# EAGLE design so28 (EAGLE 5.11)
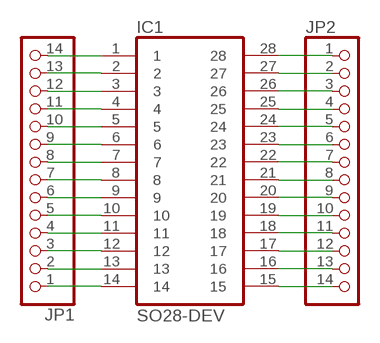
[diagram p0: schematic, sheet 1]

## Parts
IC1  SO28-DEV  [SO28W]
JP1  PINHD-1X14  [1X14]
JP2  PINHD-1X14  [1X14]

## Nets
N$1: IC1.1 JP1.14
N$2: IC1.2 JP1.13
N$3: IC1.3 JP1.12
N$4: IC1.4 JP1.11
N$5: IC1.5 JP1.10
N$6: IC1.6 JP1.9
N$7: IC1.7 JP1.8
N$8: IC1.8 JP1.7
N$9: IC1.9 JP1.6
N$10: IC1.10 JP1.5
N$11: IC1.11 JP1.4
N$12: IC1.12 JP1.3
N$13: IC1.13 JP1.2
N$14: IC1.14 JP1.1
N$15: IC1.15 JP2.14
N$16: IC1.16 JP2.13
N$17: IC1.17 JP2.12
N$18: IC1.18 JP2.11
N$19: IC1.19 JP2.10
N$20: IC1.20 JP2.9
N$21: IC1.21 JP2.8
N$22: IC1.22 JP2.7
N$23: IC1.23 JP2.6
N$24: IC1.24 JP2.5
N$25: IC1.25 JP2.4
N$26: IC1.26 JP2.3
N$27: IC1.27 JP2.2
N$28: IC1.28 JP2.1

## Library data of the parts
IC1 = packages:SO28-DEV
JP1 JP2 = pinhead:PINHD-1X14: PIN HEADER

## Board
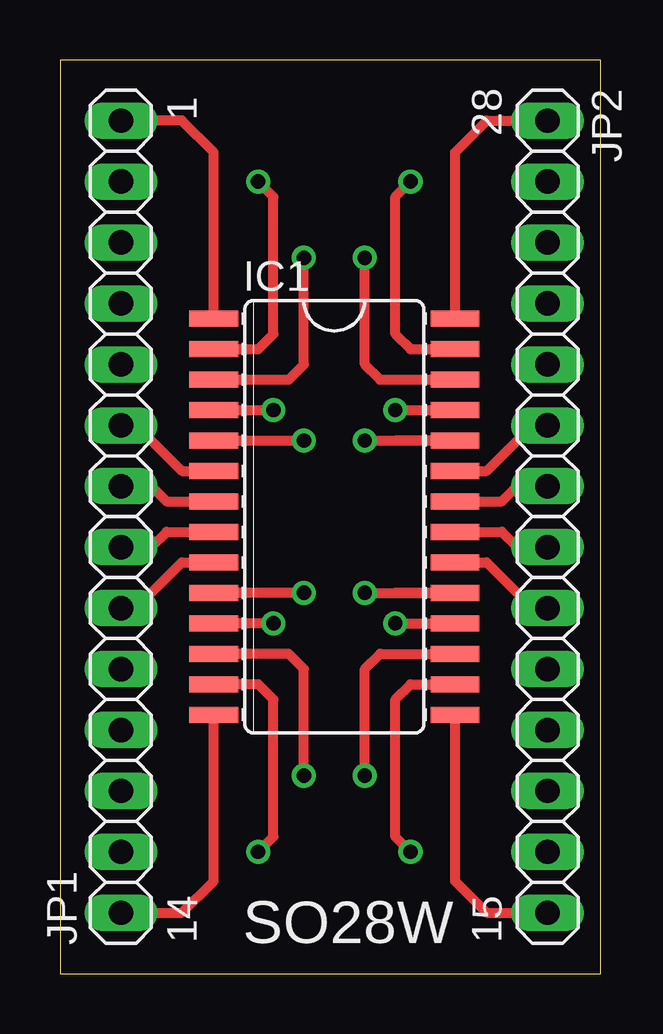
[diagram p1: board, top side]
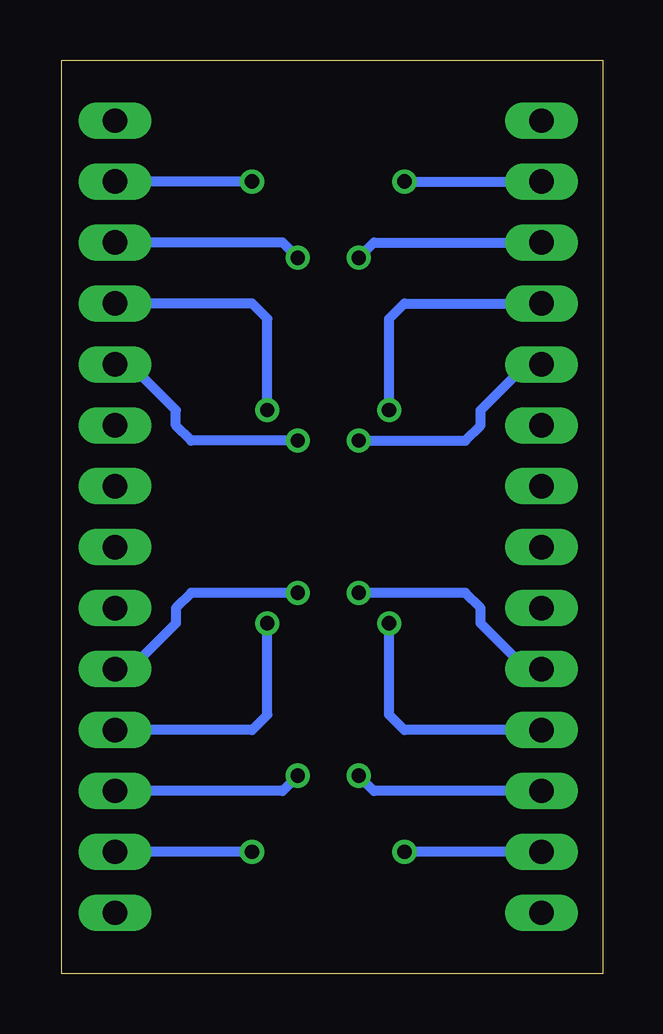
[diagram p2: board, bottom side, seen from below]

Size 22.53 x 38.09 mm. Coordinates in mm from the lower left corner, seen from the top.
Outline: 0,0 22.53,0 22.53,38.09 0,38.09 0,0
Copper layers (1*16): Top 0.035mm / dielectric 1.5mm / Bottom 0.035mm
Design rules "default": minimum track width 10mil, minimum drill 24mil, track to track 8mil, track to pad 8mil, pad to pad 8mil, via to via 8mil, smd to smd 8mil, copper to edge 40mil, drill to drill 8mil, minimum pad ring 10mil, minimum via ring 8mil, stop-mask expansion 4mil, vias tented up to drill 0mil, thermal gap 10mil

### Footprints (pad centres in the part's own frame; a part is rotated, then mirrored left to right if it is on the bottom)
SO28W = smd 0.66 x 2.032: 1 -8.255,-5.029; 2 -6.985,-5.029; 3 -5.715,-5.029; 4 -4.445,-5.029; 5 -3.175,-5.029; 6 -1.905,-5.029; 7 -0.635,-5.029; 8 0.635,-5.029; 9 1.905,-5.029; 10 3.175,-5.029; 11 4.445,-5.029; 12 5.715,-5.029; 13 6.985,-5.029; 14 8.255,-5.029; 15 8.255,5.029; 16 6.985,5.029; 17 5.715,5.029; 18 4.445,5.029; 19 3.175,5.029; 20 1.905,5.029; 21 0.635,5.029; 22 -0.635,5.029; 23 -1.905,5.029; 24 -3.175,5.029; 25 -4.445,5.029; 26 -5.715,5.029; 27 -6.985,5.029; 28 -8.255,5.029
1X14 = drill 1.016 long: 1 -16.51,0; 2 -13.97,0; 3 -11.43,0; 4 -8.89,0; 5 -6.35,0; 6 -3.81,0; 7 -1.27,0; 8 1.27,0; 9 3.81,0; 10 6.35,0; 11 8.89,0; 12 11.43,0; 13 13.97,0; 14 16.51,0

### Placement (x,y rotation side)
IC1  11.43,19.05 270 top
JP1  2.54,19.05 90 top
JP2  20.32,19.05 270 top

### Tracks (layer width: path | path; a pad name or v marks a point on that pad's centre or on a via)
N$1
  Top 0.406: IC1.1 6.4,34.24 5.08,35.56 JP1.14
N$2  (via drill 0.6)
  Top 0.406: IC1.2 8.26,26.04 8.89,26.67 8.89,32.38 v8.26,33.02
  Bottom 0.406: v8.26,33.02 JP1.13
N$3  (via drill 0.6)
  Top 0.406: IC1.3 9.53,24.77 10.16,25.4 v10.16,29.84
  Bottom 0.406: v10.16,29.84 9.53,30.48 JP1.12
N$4  (via drill 0.6)
  Top 0.406: IC1.4 v8.89,23.5
  Bottom 0.406: v8.89,23.5 8.89,27.3 8.26,27.94 JP1.11
N$5  (via drill 0.6)
  Top 0.406: 8.89,22.23 IC1.5 v10.16,22.23
  Bottom 0.406: v10.16,22.23 5.71,22.23 5.08,22.86 5.08,23.5 3.17,25.4 JP1.10
N$6
  Top 0.406: IC1.6 5.08,20.95 3.17,22.86 JP1.9
N$7
  Top 0.406: IC1.7 4.45,19.68 3.81,20.32 JP1.8
N$8
  Top 0.406: IC1.8 4.45,18.41 3.81,17.78 JP1.7
N$9
  Top 0.406: IC1.9 5.08,17.14 3.17,15.24 JP1.6
N$10  (via drill 0.6)
  Top 0.406: v10.16,15.88 IC1.10
  Bottom 0.406: v10.16,15.88 5.71,15.88 5.08,15.24 5.08,14.61 3.17,12.7 JP1.5
N$11  (via drill 0.6)
  Top 0.406: v8.89,14.61 IC1.11
  Bottom 0.406: v8.89,14.61 8.89,10.79 8.26,10.16 JP1.4
N$12  (via drill 0.6)
  Top 0.406: IC1.12 9.53,13.34 10.16,12.7 v10.16,8.26
  Bottom 0.406: v10.16,8.26 9.53,7.62 JP1.3
N$13  (via drill 0.6)
  Top 0.406: IC1.13 8.26,12.06 8.89,11.43 8.89,5.71 v8.26,5.08
  Bottom 0.406: JP1.2 v8.26,5.08
N$14
  Top 0.406: IC1.14 6.4,3.86 5.08,2.54 JP1.1
N$15
  Top 0.406: IC1.15 16.46,3.86 17.78,2.54 JP2.14
N$16  (via drill 0.6)
  Top 0.406: IC1.16 14.61,12.06 13.97,11.43 13.97,5.71 v14.61,5.08
  Bottom 0.406: v14.61,5.08 JP2.13
N$17  (via drill 0.6)
  Top 0.406: 16.51,13.34 IC1.17 13.34,13.34 12.7,12.7 v12.7,8.26
  Bottom 0.406: v12.7,8.26 13.34,7.62 JP2.12
N$18  (via drill 0.6)
  Top 0.406: v13.97,14.61 IC1.18
  Bottom 0.406: v13.97,14.61 13.97,10.79 14.61,10.16 JP2.11
N$19  (via drill 0.6)
  Top 0.406: 13.97,15.88 IC1.19 v12.7,15.88
  Bottom 0.406: v12.7,15.88 17.14,15.88 17.78,15.24 17.78,14.61 19.68,12.7 JP2.10
N$20
  Top 0.406: IC1.20 17.78,17.14 19.68,15.24 JP2.9
N$21
  Top 0.406: IC1.21 18.41,18.41 19.05,17.78 JP2.8
N$22
  Top 0.406: IC1.22 18.41,19.68 19.05,20.32 JP2.7
N$23
  Top 0.406: IC1.23 17.78,20.95 19.68,22.86 JP2.6
N$24  (via drill 0.6)
  Top 0.406: IC1.24 17.14,22.23 | IC1.24 13.97,22.23 | v12.7,22.23 IC1.24
  Bottom 0.406: v12.7,22.23 17.14,22.23 17.78,22.86 17.78,23.5 19.68,25.4 JP2.5
N$25  (via drill 0.6)
  Top 0.406: v13.97,23.5 IC1.25
  Bottom 0.406: v13.97,23.5 13.97,27.3 14.61,27.94 JP2.4
N$26  (via drill 0.6)
  Top 0.406: IC1.26 13.34,24.77 12.7,25.4 v12.7,29.84
  Bottom 0.406: v12.7,29.84 13.34,30.48 JP2.3
N$27  (via drill 0.6)
  Top 0.406: IC1.27 14.61,26.04 13.97,26.67 13.97,32.38 v14.61,33.02
  Bottom 0.406: v14.61,33.02 JP2.2
N$28
  Top 0.406: IC1.28 16.46,34.24 17.78,35.56 JP2.1

### Text on the board
tPlace: 1 | 28 | 14 | SO28W | 15